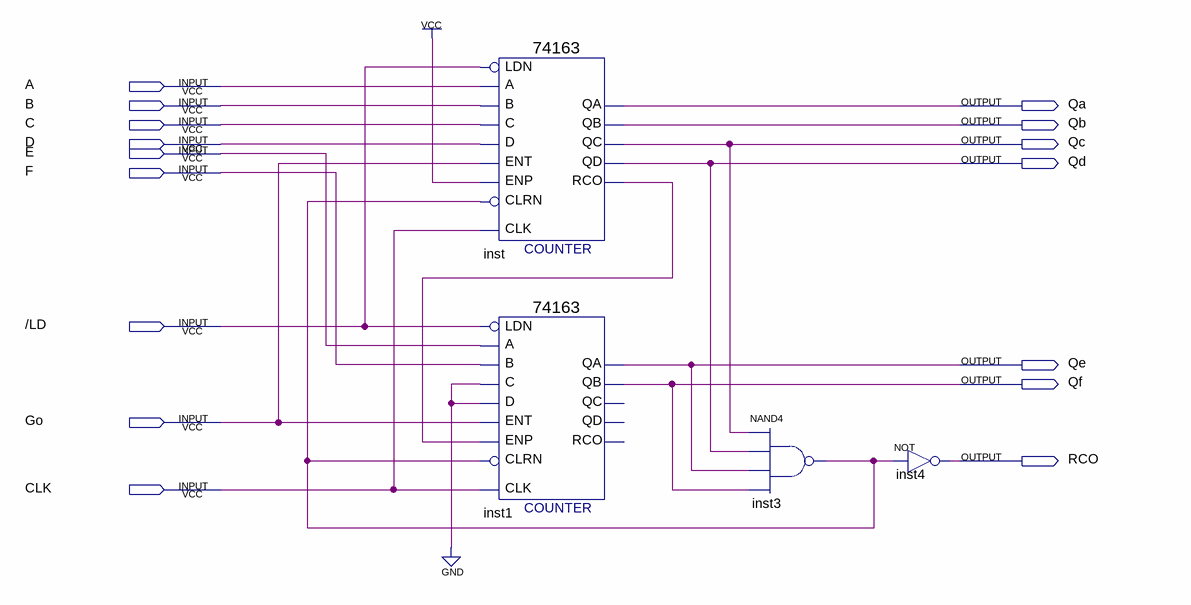
[diagram p0: schematic sheet]
// Quartus schematic mod60.bdf as structural Verilog: 4 symbols, 16 pins
module mod60 (
  input  A,
  input  B,
  input  C,
  input  D,
  input  E,
  input  F,
  input  \/LD ,
  input  Go,
  input  CLK,
  output Qa,
  output Qb,
  output Qc,
  output Qd,
  output Qe,
  output Qf,
  output RCO
);

  wire inst3_out, inst_rco;

  \74163  inst (
    .C(C), .B(B), .A(A), .ENT(Go), .D(D), .CLRN(inst3_out), .CLK(CLK), .ENP(1'b1), .LDN(\/LD ), .QA(Qa),
    .QB(Qb), .QC(Qc), .QD(Qd), .RCO(inst_rco));
  \74163  inst1 (
    .C(1'b0), .B(F), .A(E), .ENT(Go), .D(1'b0), .CLRN(inst3_out), .CLK(CLK), .ENP(inst_rco), .LDN(\/LD ),
    .QA(Qe), .QB(Qf));  // open: QC, QD, RCO
  nand inst3 (inst3_out, Qc, Qd, Qe, Qf);
  not inst4 (RCO, inst3_out);
endmodule
